# EAGLE design VIVA_PIC16_1591A (EAGLE 6.3)
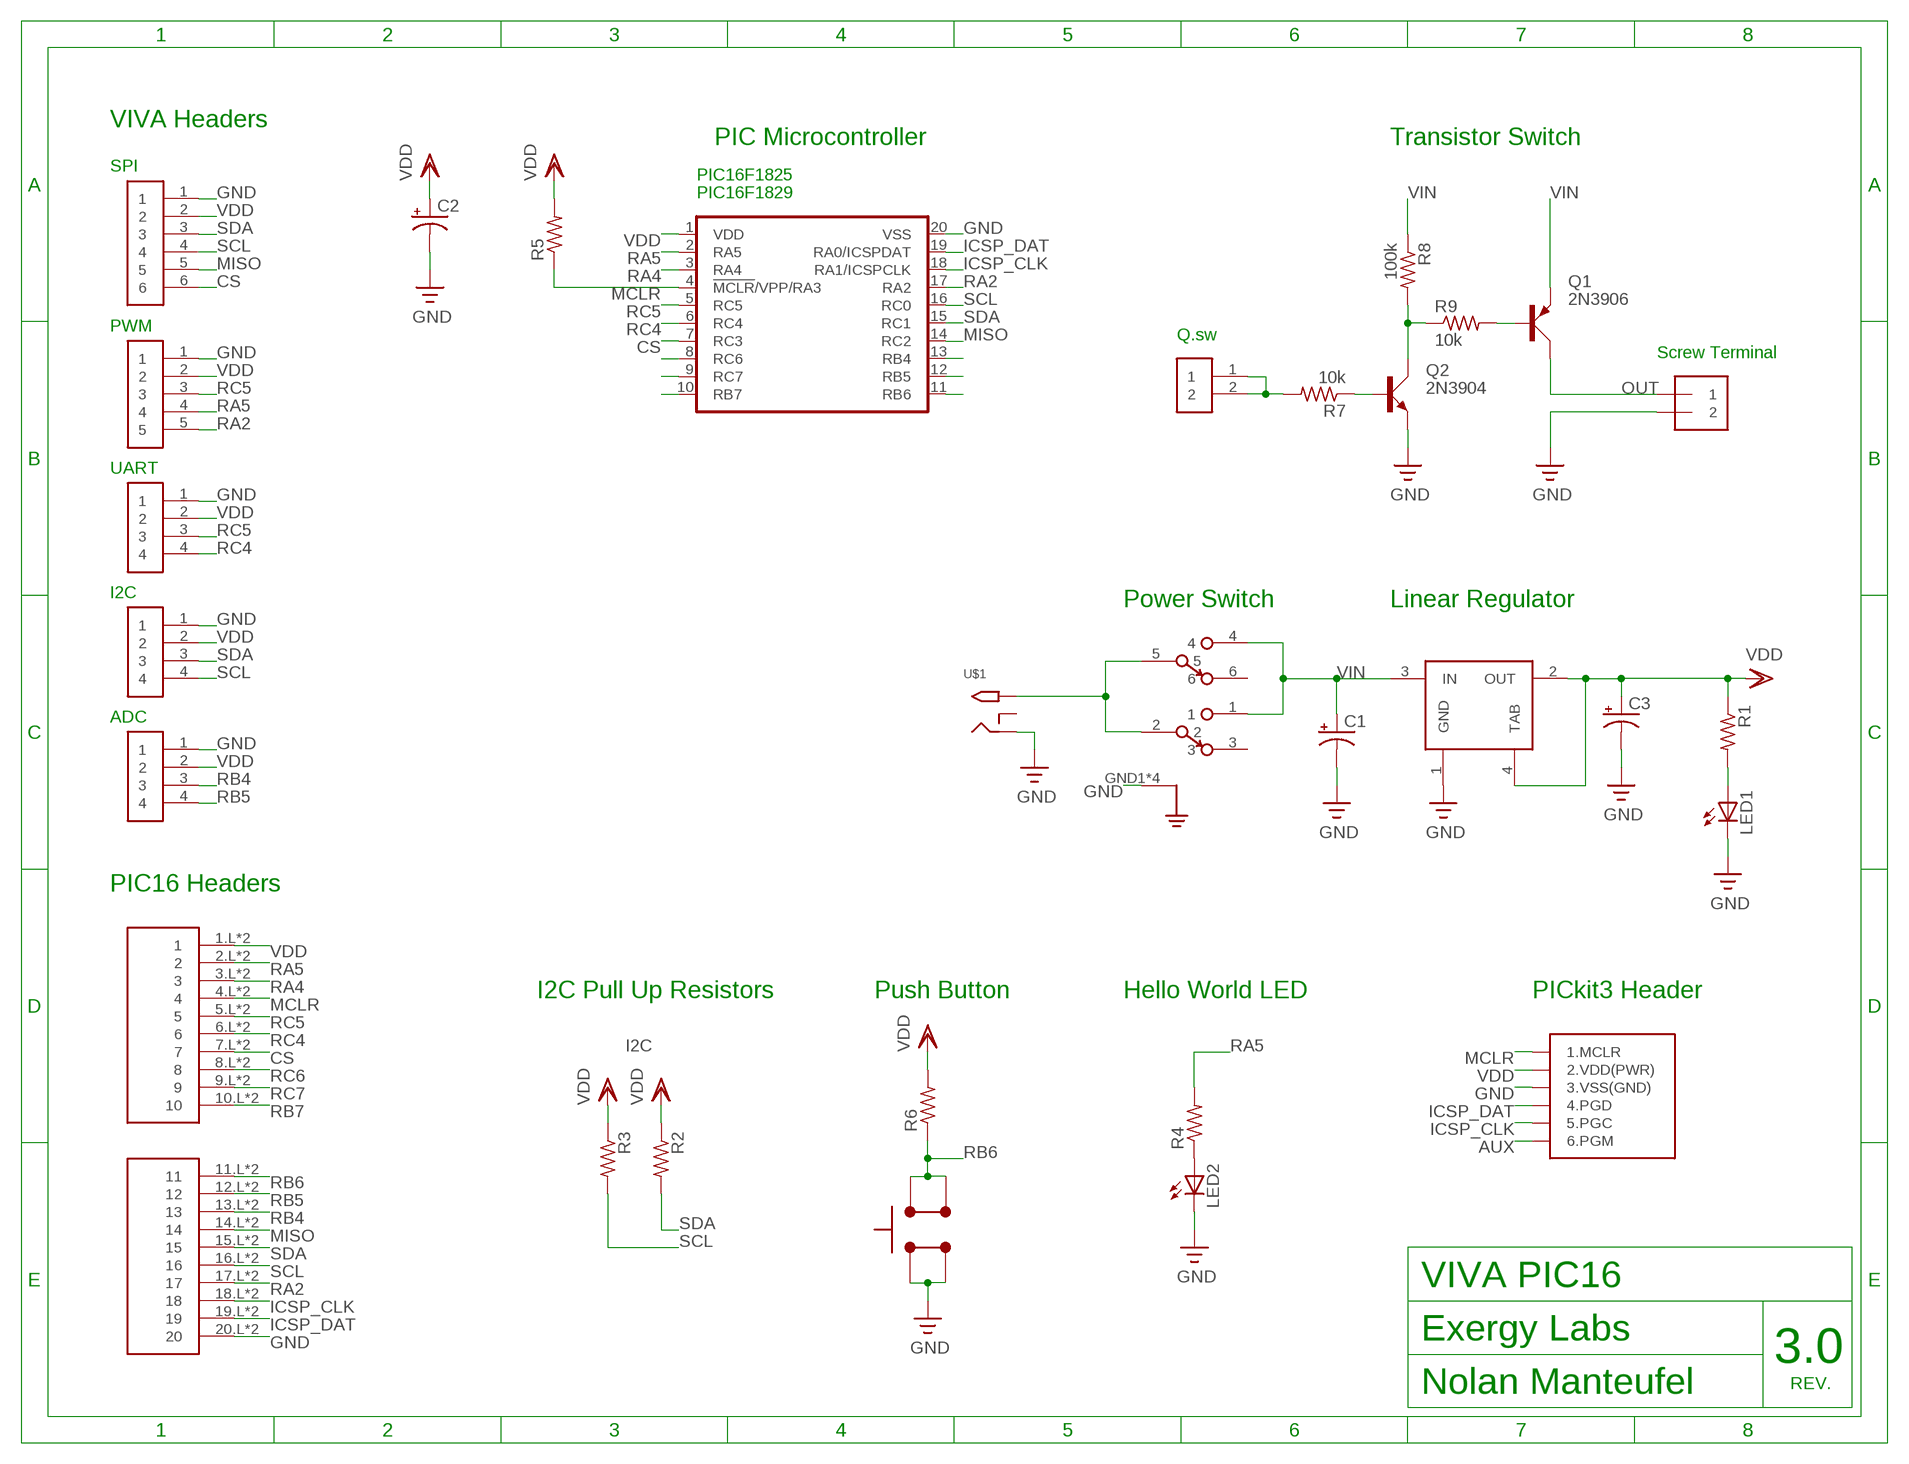
[diagram p0: schematic, sheet 1]

## Parts
C1  CPOL-USE2.5-6  [E2,5-6]
C2  CPOL-USE2.5-6  [E2,5-6]
C3  CPOL-USE2.5-6  [E2,5-6]
J1  1X2-3.5MM  [1X2-3.5MM]
LED1  LED5MM  [LED5MM]
LED2  LED5MM  [LED5MM]
PIC16F1823  PIC16F1829  [DIL20]
Q1  2N3906  2N3906TO92-EBC-OVAL  [TO92-EBC-OVAL]
Q2  2N3904  2N3904TO92-EBC-OVAL  [TO92-EBC-OVAL]
R1  R-US_0204/5  [0204/5]
R2  R-US_0204/5  [0204/5]
R3  R-US_0204/5  [0204/5]
R4  R-US_0204/5  [0204/5]
R5  R-US_0204/5  [0204/5]
R6  R-US_0204/5  [0204/5]
R7  10k  R-US_0204/5  [0204/5]
R8  100k  R-US_0204/5  [0204/5]
R9  10k  R-US_0204/5  [0204/5]
U1  REGULATOR_SCHSOT223  [SOT223]
U$1  2.1MMJACKTHM  [PJ-102A]
U$3  SWITCH_OS202013  [OS202013MT5QN1]
U$4  PUSHBUTTON_THD  [PUSHBUTTON_1301_9303]
U$5  PINS_5  [PINS_5]
U$6  PINS_4  [PINS_4]
U$7  PINS_4  [PINS_4]
U$8  PINS_4  [PINS_4]
U$9  PINS_6  [PINS_6]
U$10  PINS_2  [PINS_2]
U$11  PICKIT3  [PICKIT3]
U$12  VIVA_PIC16  [VIVA_PIC16]

## Nets
AUX: U$11.6(6.PGM)
BAT: U$1.TIP U$3.2 U$3.5
CS: PIC16F1823.7(RC3) U$9.6 U$12.7.L U$12.7.R
GND: C1.- C2.- C3.- J1.2 LED1.K(C) LED2.K(C) PIC16F1823.20(VSS) Q2.E U1.1(GND) U$1.RING U$3.GND1(GND) U$3.GND2(GND) U$3.GND3(GND) U$3.GND4(GND) U$4.1 U$4.2 U$5.1 U$6.1 U$7.1 U$8.1 U$9.1 U$11.3(3.VSS(GND)) U$12.20.L U$12.20.R
ICSP_CLK: PIC16F1823.18(RA1/ICSPCLK) U$11.5(5.PGC) U$12.18.L U$12.18.R
ICSP_DAT: PIC16F1823.19(RA0/ICSPDAT) U$11.4(4.PGD) U$12.19.L U$12.19.R
MCLR: PIC16F1823.4(!MCLR!/VPP/RA3) R5.1 U$11.1(1.MCLR) U$12.4.L U$12.4.R
MISO: PIC16F1823.14(RC2) U$9.5 U$12.14.L U$12.14.R
N$10: Q2.B R7.1
N$11: Q2.C R8.2 R9.1
N$14: Q1.B R9.2
N$19: R7.2 U$10.1 U$10.2
N$21: LED1.A R1.2
N$23: LED2.A R4.1
OUT: J1.1 Q1.C
RA2: PIC16F1823.17(RA2) U$5.5 U$12.17.L U$12.17.R
RA4: PIC16F1823.3(RA4) U$12.3.L U$12.3.R
RA5: PIC16F1823.2(RA5) R4.2 U$5.4 U$12.2.L U$12.2.R
RB4: PIC16F1823.13(RB4) U$8.3 U$12.13.L U$12.13.R
RB5: PIC16F1823.12(RB5) U$8.4 U$12.12.L U$12.12.R
RB6: PIC16F1823.11(RB6) R6.1 U$4.3 U$4.4 U$12.11.L U$12.11.R
RB7: PIC16F1823.10(RB7) U$12.10.L U$12.10.R
RC4: PIC16F1823.6(RC4) U$6.4 U$12.6.L U$12.6.R
RC5: PIC16F1823.5(RC5) U$5.3 U$6.3 U$12.5.L U$12.5.R
RC6: PIC16F1823.8(RC6) U$12.8.L U$12.8.R
RC7: PIC16F1823.9(RC7) U$12.9.L U$12.9.R
SCL: PIC16F1823.16(RC0) R3.2 U$7.4 U$9.4 U$12.16.L U$12.16.R
SDA: PIC16F1823.15(RC1) R2.2 U$7.3 U$9.3 U$12.15.L U$12.15.R
VDD: C2.+ C3.+ PIC16F1823.1(VDD) R1.1 R2.1 R3.1 R5.2 R6.2 U1.2(OUT) U1.4(TAB) U$5.2 U$6.2 U$7.2 U$8.2 U$9.2 U$11.2(2.VDD(PWR)) U$12.1.L U$12.1.R
VIN: C1.+ Q1.E R8.1 U1.3(IN) U$3.1 U$3.4
Unconnected: U$1.RING_SW U$3.3 U$3.6

## Notes on the sheet
- VIVA Headers
- PIC Microcontroller | Transistor Switch
- SPI
- PIC16F1825
- PIC16F1829
- PWM
- Q.sw
- Screw Terminal
- UART
- I2C
- Power Switch | Linear Regulator
- ADC
- PIC16 Headers
- I2C Pull Up Resistors | Push Button | Hello World LED | PICkit3 Header
- I2C
- VIVA PIC16
- Exergy Labs
- 3.0
- Nolan Manteufel | REV.

## Library data of the parts
C1-C3 = mini-nolan-ada:CPOL-US: POLARIZED CAPACITOR, American symbol
J1 = adafruit:1X2: 3.5mm Terminal block http://www.ladyada.net/library/pcb/eaglelibrary.html
LED1 LED2 = adafruit:LED: LED OSRAM: - CHIPLED LG R971, LG N971, LY N971, LG Q971, LY Q971, LO R971, LY R971 LH N974, LH R974 LS Q976, LO Q976, LY Q976 LO Q996 - Hyper CHIPLED LW Q18S LB Q993, LB Q99A, LB R99A - SideLED LS A670, LO A670, LY A670, LG A670, LP A670 LB A673, LV A673, LT A673, LW A673 LH A674 LY A675 LS A676, LA A676, LO A676, LY A676, LW A676 LS A679, LY A679, LG A679 - Hyper Micro SIDELED® LS Y876, LA Y876, LO Y876, LY Y876 LT Y87S - SmartLED LW L88C, LW L88S LB L89C, LB L89S, LG L890 LS L89K, LO L89K, LY L89K LS L896, LA L896, LO L896, LY L896 - TOPLED LS T670, LO T670, LY T670, LG T670, LP T670 LSG T670, LSP T670, LSY T670, LOP T670, LYG T670 LG T671, LOG T671, LSG T671 LB T673, LV T673, LT T673, LW T673 LH T674 LS T676, LA T676, LO T676, LY T676, LB T676, LH T676, LSB T676, LW T676 LB T67C, LV T67C, LT T67C, LS T67K, LO T67K, LY T67K, LW E67C LS E67B, LA E67B, LO E67B, LY E67B, LB E67C, LV E67C, LT E67C LW T67C LS T679, LY T679, LG T679 LS T770, LO T770, LY T770, LG T770, LP T770 LB T773, LV T773, LT T773, LW T773 LH T774 LS E675, LA E675, LY E675, LS T675 LS T776, LA T776, LO T776, LY T776, LB T776 LHGB T686 LT T68C, LB T68C - Hyper Mini TOPLED® LB M676 - Mini TOPLED Santana® LG M470 LS M47K, LO M47K, LY M47K Source: http://www.osram.convergy.de/
PIC16F1823 = microchip:PIC16F1829
Q1 = nolan-classic-kits:2N3906: PNP TRANSISTOR
Q2 = nolan-classic-kits:2N3904: NPN TRANSISTOR
R1-R9 = adafruit:R-US_: RESISTOR, American symbol
U1 = nolan-viva:REGULATOR_SCH
U$1 = adafruit:2.1MMJACK: 2.1mm x 5.5mm THM DC jack with internal switch. Digikey part #PJ-102A, 4UCON part #05537 2.1mm x 5.5mm SMT DC jack with internal switch. Digikey part #PJ-002A-SMT, 4UCON part #03267 By microbuilder.eu & adafruit.com
U$3 = nolan-viva:SWITCH_OS202013
U$4 = nolan-viva:PUSHBUTTON_THD
U$5 = nolan-viva:PINS_5
U$6-U$8 = nolan-viva:PINS_4
U$9 = nolan-viva:PINS_6
U$10 = nolan-classic-kits:PINS_2
U$11 = nolan-viva:PICKIT3
U$12 = nolan-viva:VIVA_PIC16

## Board
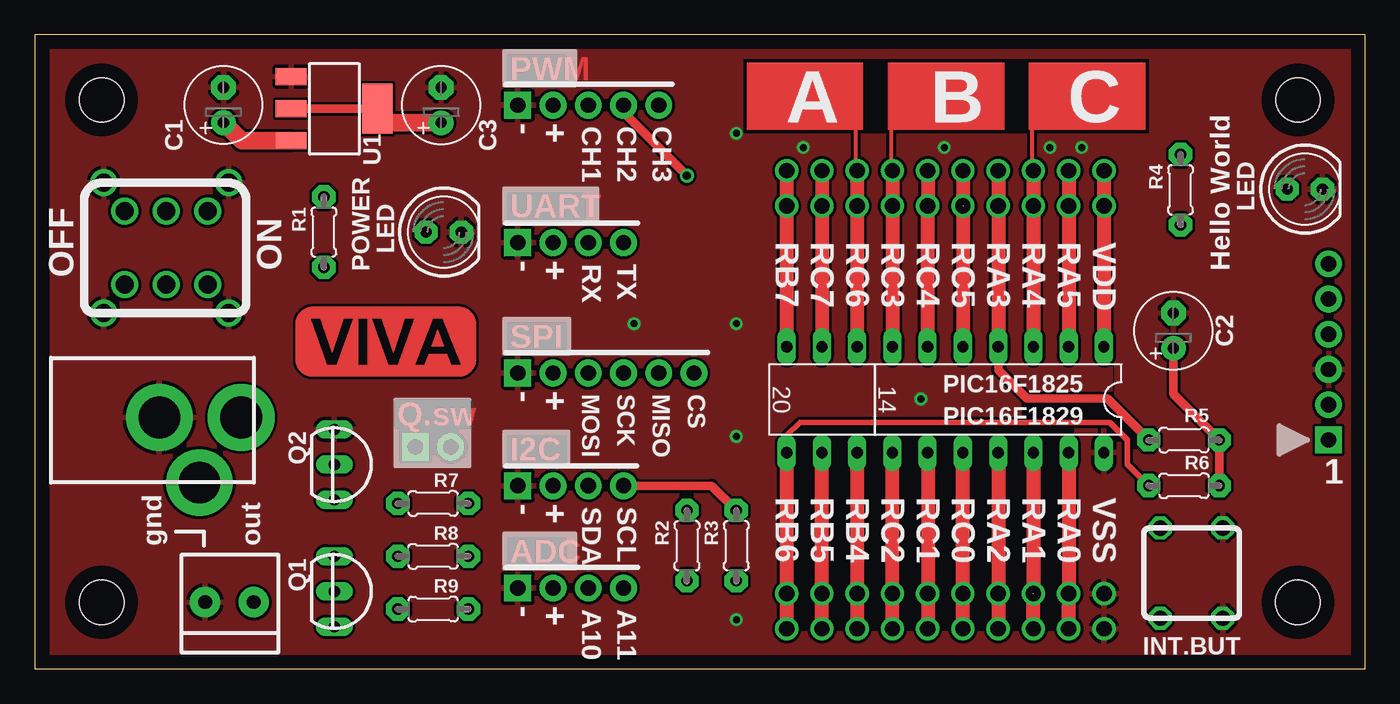
[diagram p1: board, top side]
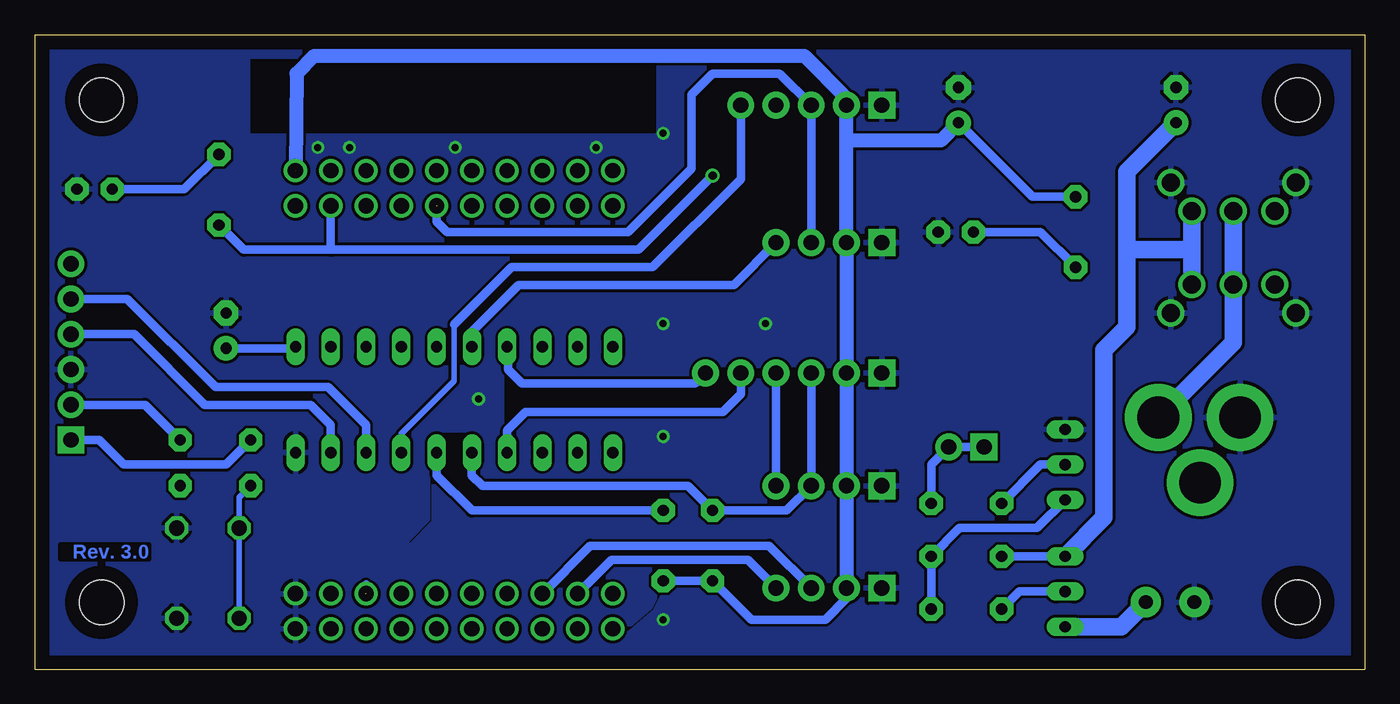
[diagram p2: board, bottom side, seen from below]

Size 95.83 x 45.72 mm. Coordinates in mm from the lower left corner, seen from the top.
Outline: 95.83,45.72 95.83,0 0,0 0,45.72 95.83,45.72
Copper layers (1*16): Top 0.035mm / dielectric 1.5mm / Bottom 0.035mm
Design rules "default *": minimum track width 10mil, minimum drill 24mil, track to track 8mil, track to pad 8mil, pad to pad 8mil, via to via 8mil, smd to smd 8mil, copper to edge 40mil, drill to drill 8mil, minimum pad ring 10mil, minimum via ring 8mil, stop-mask expansion 4mil, vias tented up to drill 20mil, thermal gap 10mil
Holes 3.2 mm at 4.82,41.01 4.82,4.81 91.01,4.81 91.02,41.01
tRestrict: area 51.1,38.6 to 80.3,43.9; 4 lines
bRestrict: area 76.5,38.6 to 80.3,43.9; area 51.1,38.6 to 76.2,43.4; 6 lines

### Footprints (pad centres in the part's own frame; a part is rotated, then mirrored left to right if it is on the bottom)
E2,5-6 = drill 0.813 pad 1.778: + -1.27,0 | drill 0.813 pad 1.778 octagon: - 1.27,0
1X2-3.5MM = drill 1 pad 2.184: 1 1.8,0; 2 -1.7,0
LED5MM = drill 0.813 pad 1.676 octagon: A -1.27,0; K 1.27,0
DIL20 = drill 0.813 long: 1 0,0; 2 2.54,0; 3 5.08,0; 4 7.62,0; 5 10.16,0; 6 12.7,0; 7 15.24,0; 8 17.78,0; 9 20.32,0; 10 22.86,0; 11 22.86,7.62; 12 20.32,7.62; 13 17.78,7.62; 14 15.24,7.62; 15 12.7,7.62; 16 10.16,7.62; 17 7.62,7.62; 18 5.08,7.62; 19 2.54,7.62; 20 0,7.62
TO92-EBC-OVAL = drill 0.813 long: B 0,-1.27; C 2.54,-1.27; E -2.54,-1.27
0204/5 = drill 0.813 pad 1.676 octagon: 1 -2.54,0; 2 2.54,0
SOT223 = smd 1.219 x 2.235: 1 -2.311,-3.099; 2 0,-3.099; 3 2.311,-3.099 | smd 3.6 x 2.2: 4 0,3.099
PJ-102A = drill 3 pad 4.8: RING 0.1,-3.39; RING_SW -4.6,-6.29; TIP 0.1,-9.29
OS202013MT5QN1 = drill 1.3: 1 1.499,7.353; 2 4.496,7.353; 3 7.493,7.353; 4 1.499,2.045; 5 4.496,2.045; 6 7.493,2.045; GND1 0,9.398; GND2 8.992,9.398; GND3 0,0; GND4 8.992,0
PUSHBUTTON_1301_9303 = drill 1.1 octagon: 1 0,0; 2 0,6.5; 3 4.5,0; 4 4.5,6.5
PINS_5 = drill 1.1 pad 1.93 square: 1 0,0 | drill 1.1 pad 1.93: 2 2.54,0; 3 5.08,0; 4 7.62,0; 5 10.16,0
PINS_4 = drill 1.1 pad 1.93 square: 1 0,0 | drill 1.1 pad 1.93: 2 2.54,0; 3 5.08,0; 4 7.62,0
PINS_6 = drill 1.1 pad 1.93 square: 1 0,0 | drill 1.1 pad 1.93: 2 2.54,0; 3 5.08,0; 4 7.62,0; 5 10.16,0; 6 12.7,0
PINS_2 = drill 1.1 pad 1.93 square: 1 0,0 | drill 1.1 pad 1.93: 2 2.54,0
PICKIT3 = drill 1.1 pad 1.93 square: 1 0,0 | drill 1.1 pad 1.93: 2 2.54,0; 3 5.08,0; 4 7.62,0; 5 10.16,0; 6 12.7,0
VIVA_PIC16 = drill 1.1 pad 1.676: 1.L -2.54,0; 1.R 0,0; 2.L -2.54,-2.54; 2.R 0,-2.54; 3.L -2.54,-5.08; 3.R 0,-5.08; 4.L -2.54,-7.62; 4.R 0,-7.62; 5.L -2.54,-10.16; 5.R 0,-10.16; 6.L -2.54,-12.7; 6.R 0,-12.7; 7.L -2.54,-15.24; 7.R 0,-15.24; 8.L -2.54,-17.78; 8.R 0,-17.78; 9.L -2.54,-20.32; 9.R 0,-20.32; 10.L -2.54,-22.86; 10.R 0,-22.86; 11.L 27.94,-22.86; 11.R 30.48,-22.86; 12.L 27.94,-20.32; 12.R 30.48,-20.32; 13.L 27.94,-17.78; 13.R 30.48,-17.78; 14.L 27.94,-15.24; 14.R 30.48,-15.24; 15.L 27.94,-12.7; 15.R 30.48,-12.7; 16.L 27.94,-10.16; 16.R 30.48,-10.16; 17.L 27.94,-7.62; 17.R 30.48,-7.62; 18.L 27.94,-5.08; 18.R 30.48,-5.08; 19.L 27.94,-2.54; 19.R 30.48,-2.54; 20.L 27.94,0; 20.R 30.48,0

### Placement (x,y rotation side)
C1  13.6,40.65 90 top
C2  82.04,24.38 90 top
C3  29.28,40.64 90 top
J1  13.97,4.83 0 top
LED1  29.46,31.5 0 top
LED2  91.51,34.59 0 top
PIC16F1823  77.03,23.22 180 top
Q1  22.86,5.59 270 top
Q2  22.86,14.73 270 top
R1  20.83,31.5 270 top
R2  46.99,8.89 90 top
R3  50.55,8.89 90 top
R4  82.55,34.54 270 top
R5  82.8,16.51 0 top
R6  82.8,13.21 0 top
R7  28.7,11.94 0 top
R8  28.7,8.13 0 top
R9  28.7,4.32 180 top
U1  21.59,40.39 270 top
U$1  5.59,18.03 90 top
U$2  [VIVA_LOGO]  18.8,21.08 0 top
U$3  13.97,35.05 180 top
U$4  85.6,10.16 180 top
U$5  34.8,40.64 0 top
U$6  34.8,30.73 0 top
U$7  34.8,13.21 0 top
U$8  34.8,5.84 0 top
U$9  34.8,21.34 0 top
U$10  27.43,16 0 top
U$11  93.22,16.51 90 top
U$12  77.04,33.38 270 top

### Tracks (layer width: path | path; a pad name or v marks a point on that pad's centre or on a via)
BAT
  Bottom 1.27: U$1.TIP 9.47,23.54 U$3.2 U$3.5
CS
  Top 1.016: U$12.7.L U$12.7.R PIC16F1823.7
  Bottom 0.61: U$9.6 48.26,20.57 60.71,20.57 61.72,21.59 61.72,23.15 PIC16F1823.7
GND  (via drill 0.5)
  other vias: 50.55,16.76 50.55,24.89 63.85,19.47 43.18,24.89 50.55,38.61 75.44,37.59 73.15,37.59 55.37,37.59 50.55,3.56 65.53,37.59
  pour Top: 0.81,0.81 0.81,44.7 95.1,44.7 95.1,0.81
  pour Bottom: 0.81,0.81 0.81,44.7 95.1,44.7 95.1,0.81
ICSP_CLK  (1 unrouted)
  Top 1.016: PIC16F1823.18 U$12.18.L U$12.18.R
  Bottom 0.61: 71.95,15.39 PIC16F1823.18 71.95,17.6 74.68,20.32 82.8,20.32 89.15,26.67 U$11.5 | U$12.18.L 71.95,6.1
ICSP_DAT
  Top 1.016: U$12.19.R U$12.19.L PIC16F1823.19
  Bottom 0.61: U$11.4 88.65,24.13 83.57,19.05 75.95,19.05 74.49,17.6 PIC16F1823.19
MCLR
  Top 0.61: PIC16F1823.4 69.41,21.55 71.48,19.49 77.29,19.49 R5.1
  Top 1.016: U$12.4.L U$12.4.R PIC16F1823.4
  Bottom 0.61: U$11.1 91.19,16.51 89.41,14.73 82.04,14.73 R5.1
MISO
  Top 1.016: U$12.14.R U$12.14.L PIC16F1823.14
  Bottom 0.61: PIC16F1823.14 61.79,17.2 60.45,18.54 46.23,18.54 44.96,19.81 U$9.5
N$7
  Top 0.305: 59.18,35.81 59.18,39.88
N$8
  Top 0.305: 61.72,36.07 61.72,39.88 64.01,39.88
N$9
  Top 0.305: 71.88,35.56 71.88,39.37 73.91,39.37
N$10
  Bottom 0.61: Q2.B 23.37,14.73 R7.1
N$11
  Bottom 0.61: R9.1 R8.2 29.21,10.16 23.62,10.16 Q2.C
N$14
  Bottom 0.61: Q1.B 24.89,5.59 R9.2
N$19
  Bottom 0.61: U$10.1 U$10.2 31.24,14.73 R7.2
N$21
  Bottom 0.61: R1.2 23.37,31.5 LED1.A
N$23
  Bottom 0.61: LED2.A 85.04,34.59 R4.1
OUT
  Bottom 1.27: Q1.C 17.55,3.05 J1.1
RA2
  Top 1.016: PIC16F1823.17 U$12.17.L U$12.17.R
  Bottom 0.406: 65.61,24.84 65.61,20.78 69.41,16.95 PIC16F1823.17
  Bottom 0.61: 65.61,24.84 61.47,28.96 51.31,28.96 45.09,35.18 44.96,35.31 U$5.5
RA4
  Top 1.016: U$12.3.L U$12.3.R PIC16F1823.3
RA5  (via drill 0.6)
  Top 0.61: U$5.4 42.42,40.13 v46.99,35.56
  Top 1.016: U$12.2.L U$12.2.R PIC16F1823.2
  Bottom 0.61: v46.99,35.56 52.32,30.23 74.42,30.23 74.49,30.23 | 74.49,30.23 80.77,30.23 R4.2 | U$12.2.R 74.49,30.23
RB4
  Top 1.016: PIC16F1823.13 U$12.13.L U$12.13.R
  Bottom 0.61: U$12.13.L 55.8,8.89 42.93,8.89 U$8.3
RB5
  Top 1.016: U$12.12.R U$12.12.L PIC16F1823.12
  Bottom 0.61: U$12.12.L 54.28,7.87 44.45,7.87 U$8.4
RB6
  Top 0.406: PIC16F1823.11 54.17,16.84 55.12,17.78 77.47,17.78 78.74,16.51 78.74,14.73 R6.1
  Top 1.016: PIC16F1823.11 U$12.11.L U$12.11.R
  Bottom 0.406: R6.1 81.1,12.37 U$4.3 U$4.4
RB7
  Top 1.016: U$12.10.L U$12.10.R PIC16F1823.10
RC4
  Top 1.016: U$12.6.L U$12.6.R PIC16F1823.6
  Bottom 0.61: PIC16F1823.6 64.33,24.31 60.96,27.69 45.47,27.69 U$6.4
RC5  (1 unrouted)
  Top 1.016: U$12.5.L U$12.5.R PIC16F1823.5
  Bottom 0.61: U$12.5.R 66.87,32.26 66.11,31.5 53.09,31.5 48.51,36.07 48.51,41.4 46.99,42.93 42.16,42.93 U$5.3 U$6.3
RC6
  Top 1.016: U$12.8.L U$12.8.R PIC16F1823.8
RC7
  Top 1.016: U$12.9.L U$12.9.R PIC16F1823.9
SCL
  Top 0.61: U$7.4 48.77,13.21 R3.2
  Top 1.016: U$12.16.R U$12.16.L PIC16F1823.16
  Bottom 0.61: 66.87,14.55 PIC16F1823.16 66.87,13.97 64.33,11.43 R3.2 | U$9.4 U$7.4
SDA
  Top 1.016: PIC16F1823.15 U$12.15.L U$12.15.R
  Bottom 0.61: U$9.3 U$7.3 41.66,11.43 R2.2 48.77,13.21 63.58,13.21 64.34,13.97 PIC16F1823.15
VDD  (1 unrouted)
  Top 0.61: C2.+ 82.04,19.81 R5.2 R6.2 | U1.2 U1.4
  Top 1.016: U$12.1.L U$12.1.R PIC16F1823.1
  Top 1.27: U1.4 24.69,39.37 C3.+
  Bottom 0.61: R3.1 R2.1 44.2,3.56 38.86,3.56 37.34,5.08 37.34,5.33 U$8.2 | C2.+ 77.14,23.11 PIC16F1823.1 | R1.1 23.95,34.04 C3.+ | U$11.2 87.88,19.05 R5.2
  Bottom 1.016: U$12.1.L 77.03,36 76.96,42.93 75.69,44.2 40.39,44.2 37.34,41.15 U$5.2 37.34,38.1 | C3.+ 30.55,38.1 37.34,38.1 | 37.34,38.1 U$6.2 U$9.2 U$7.2 37.34,5.33
VIN
  Top 1.27: U1.3 14.91,38.08 C1.+
  Bottom 0.61: Q1.E R8.1
  Bottom 1.27: 17.14,30.23 17.14,24.64 18.8,22.99 18.8,10.92 Q1.E | 17.14,30.23 12.47,30.23 | C1.+ 17.14,35.84 17.14,30.23 | U$3.4 12.47,30.23 | U$3.1 12.47,30.23
(copper drawn outside any net)
  shapes: Top area x3

### Text on the board
Top: PWM | UART | SPI | Q.sw | I2C | ADC
Bottom: Rev. 3.0
tPlace: - | + | CH1 | CH2 | CH3 | A | B | C | LED | RB7 | RC7 | RC6 | RC3 | RC4 | RC5 | RA3 | RA4 | RA5 | VDD | LED | ON | POWER | - | + | RX | TX | Hello World | OFF | - | + | MOSI | SCK | MISO | CS | 20 | 14 | PIC16F1825 | PIC16F1829 | 1 | - | + | SDA | SCL | RB6 | RB5 | RB4 | RC2 | RC1 | RC0 | RA2 | RA1 | RA0 | VSS | gnd | out | - | + | A10 | A11 | INT.BUT
tStop: PWM | UART | SPI | Q.sw | I2C | ADC
bStop: Rev. 3.0